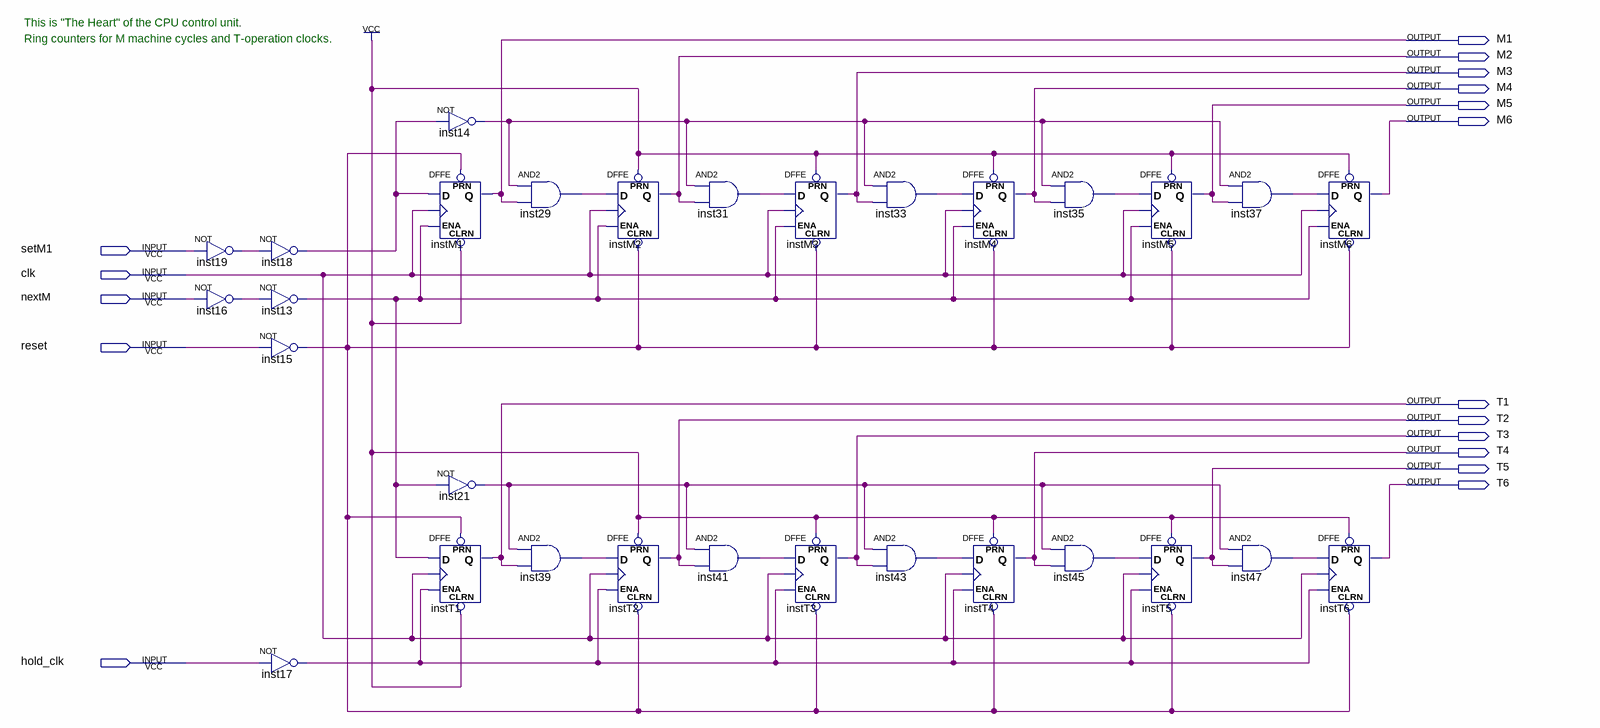
[diagram p0: schematic sheet]
// Quartus schematic the_heart.bdf as structural Verilog: 30 symbols, 17 pins
module the_heart (
  input  setM1,
  input  clk,
  input  nextM,
  input  reset,
  input  hold_clk,
  output M1,
  output M2,
  output M3,
  output M4,
  output M5,
  output M6,
  output T1,
  output T2,
  output T3,
  output T4,
  output T5,
  output T6
);

  wire inst13_out, inst14_out, inst15_out, inst16_out, inst17_out, inst18_out, inst19_out, inst21_out,
       inst29_out, inst31_out, inst33_out, inst35_out, inst37_out, inst39_out, inst41_out, inst43_out,
       inst45_out, inst47_out;

  not inst19 (inst19_out, setM1);
  not inst16 (inst16_out, nextM);
  not inst18 (inst18_out, inst19_out);
  not inst13 (inst13_out, inst16_out);
  not inst15 (inst15_out, reset);
  not inst17 (inst17_out, hold_clk);
  not inst14 (inst14_out, inst18_out);
  DFFE instM1 (.PRN(inst15_out), .CLRN(1'b1), .D(inst18_out), .CLK(clk), .ENA(inst13_out), .Q(M1));
  not inst21 (inst21_out, inst13_out);
  DFFE instT1 (.PRN(inst15_out), .CLRN(1'b1), .D(inst13_out), .CLK(clk), .ENA(inst17_out), .Q(T1));
  and inst29 (inst29_out, inst14_out, M1);
  and inst39 (inst39_out, inst21_out, T1);
  DFFE instM2 (.PRN(1'b1), .CLRN(inst15_out), .D(inst29_out), .CLK(clk), .ENA(inst13_out), .Q(M2));
  DFFE instT2 (.PRN(1'b1), .CLRN(inst15_out), .D(inst39_out), .CLK(clk), .ENA(inst17_out), .Q(T2));
  and inst31 (inst31_out, inst14_out, M2);
  and inst41 (inst41_out, inst21_out, T2);
  DFFE instM3 (.PRN(1'b1), .CLRN(inst15_out), .D(inst31_out), .CLK(clk), .ENA(inst13_out), .Q(M3));
  DFFE instT3 (.PRN(1'b1), .CLRN(inst15_out), .D(inst41_out), .CLK(clk), .ENA(inst17_out), .Q(T3));
  and inst33 (inst33_out, inst14_out, M3);
  and inst43 (inst43_out, inst21_out, T3);
  DFFE instM4 (.PRN(1'b1), .CLRN(inst15_out), .D(inst33_out), .CLK(clk), .ENA(inst13_out), .Q(M4));
  DFFE instT4 (.PRN(1'b1), .CLRN(inst15_out), .D(inst43_out), .CLK(clk), .ENA(inst17_out), .Q(T4));
  and inst35 (inst35_out, inst14_out, M4);
  and inst45 (inst45_out, inst21_out, T4);
  DFFE instM5 (.PRN(1'b1), .CLRN(inst15_out), .D(inst35_out), .CLK(clk), .ENA(inst13_out), .Q(M5));
  DFFE instT5 (.PRN(1'b1), .CLRN(inst15_out), .D(inst45_out), .CLK(clk), .ENA(inst17_out), .Q(T5));
  and inst37 (inst37_out, inst14_out, M5);
  and inst47 (inst47_out, inst21_out, T5);
  DFFE instM6 (.PRN(1'b1), .CLRN(inst15_out), .D(inst37_out), .CLK(clk), .ENA(inst13_out), .Q(M6));
  DFFE instT6 (.PRN(1'b1), .CLRN(inst15_out), .D(inst47_out), .CLK(clk), .ENA(inst17_out), .Q(T6));

  // Notes on the sheet:
  //   This is "The Heart" of the CPU control unit.
  //   Ring counters for M machine cycles and T-operation clocks.
endmodule
